# EAGLE design 6relayBoard (EAGLE 6.3)
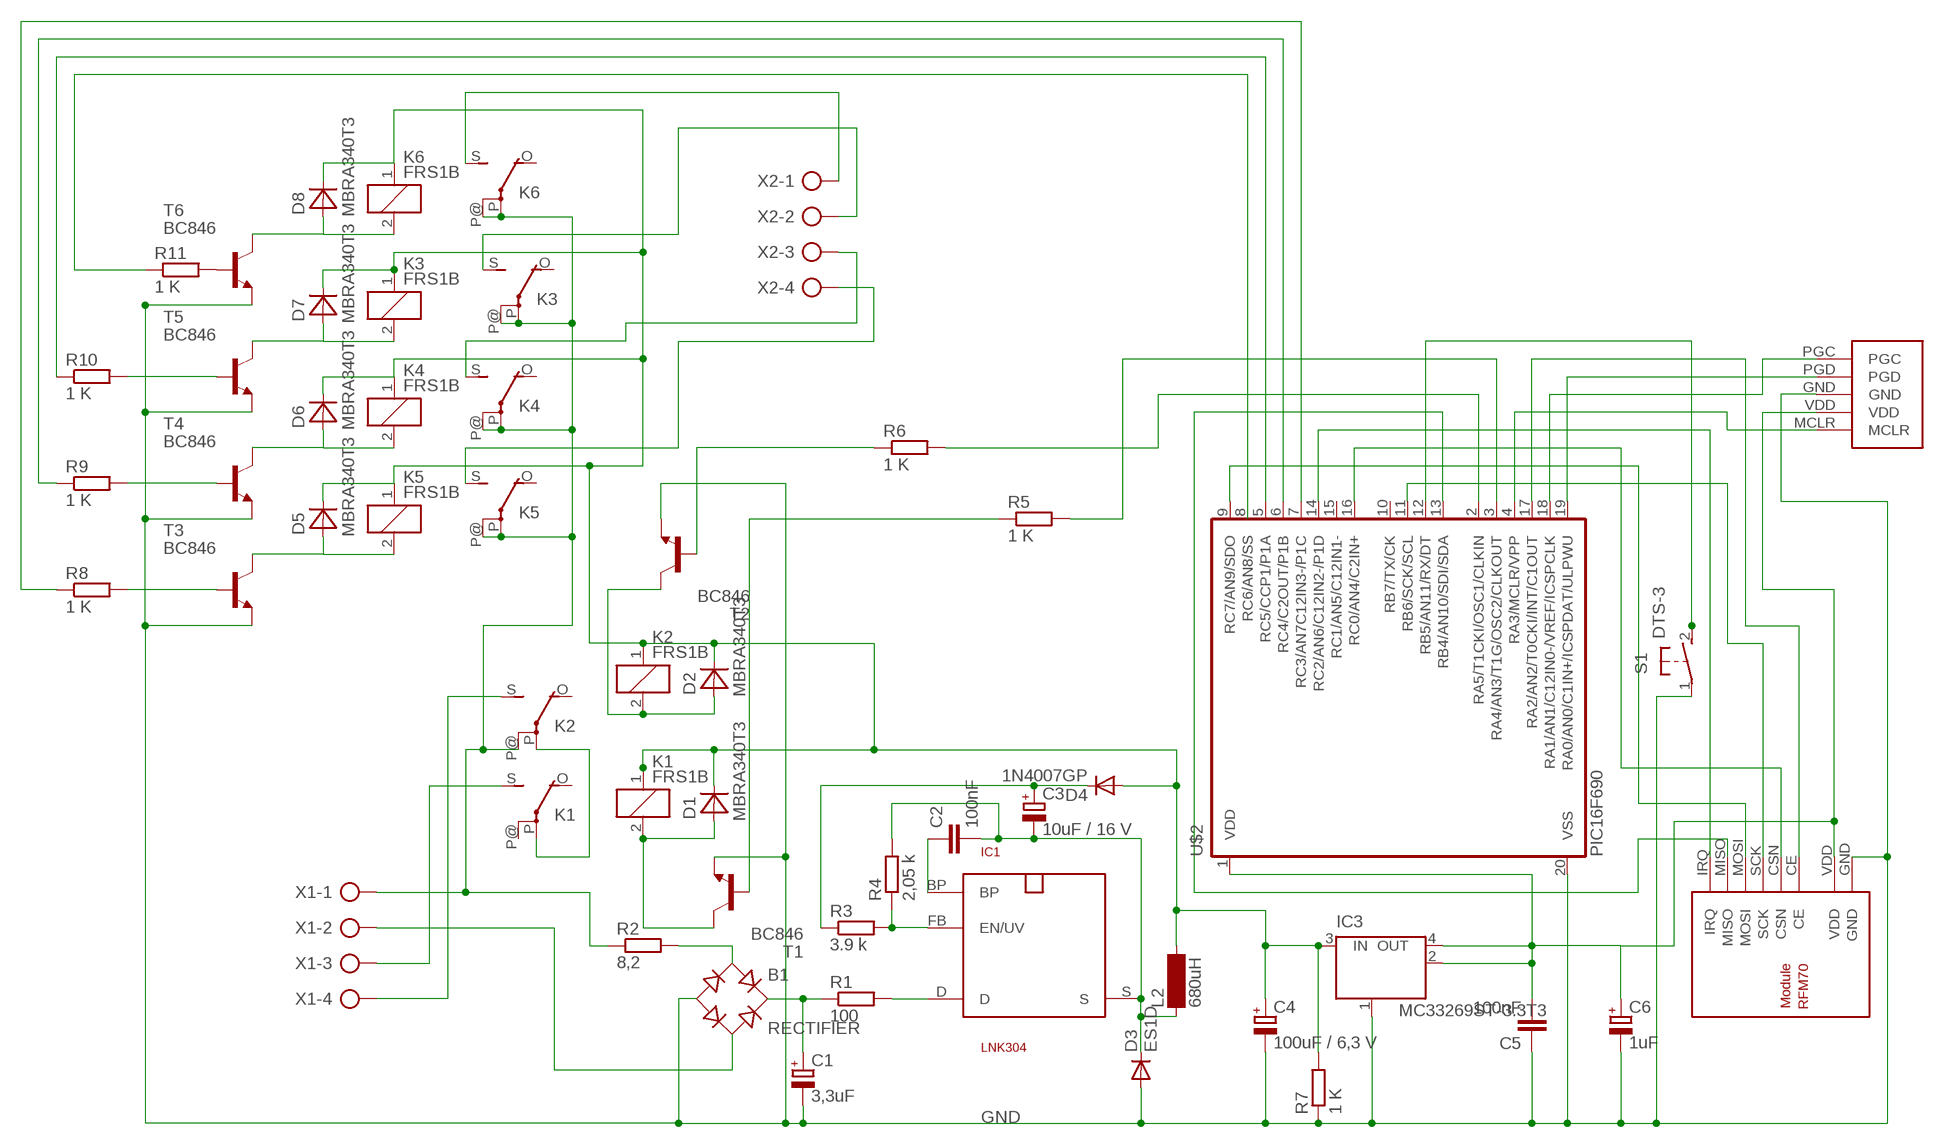
[diagram p0: schematic, sheet 1]

## Parts
B1  RECTIFIER  RECTIFIER-S40  [TO-269AA]
C1  3,3uF  CPOL-EUE5-10.5  [E5-10,5]
C2  100nF  C-EUC2012  [C2012]
C3  10uF / 16 V  CPOL-EUSMCC  [SMC_C]
C4  100uF / 6,3 V  CPOL-EUE2.5-5  [E2,5-5]
C5  100nF  C-EUC2012  [C2012]
C6  1uF  CPOL-EUSMCA  [SMC_A]
D1  MBRA340T3  [SMA]
D2  MBRA340T3  [SMA]
D3  ES1D  DIODE-DO214AC  [DO214AC]
D4  1N4007GP  DIODE-DO214AA  [DO214AA]
D5  MBRA340T3  [SMA]
D6  MBRA340T3  [SMA]
D7  MBRA340T3  [SMA]
D8  MBRA340T3  [SMA]
IC1  LNK304  SO-8C  [SO-8C]
IC3  MC33269ST-3.3T3  [SOT223]
K1  FRS1B  [FRS1B]
K2  FRS1B  [FRS1B]
K3  FRS1B  [FRS1B]
K4  FRS1B  [FRS1B]
K5  FRS1B  [FRS1B]
K6  FRS1B  [FRS1B]
L2  680uH  BS11  [BS11]
R1  100  R-EU_R2512W  [R2512W]
R2  8,2  R-EU_0411/12  [0411/12]
R3  3.9 k  R-EU_M2012  [M2012]
R4  2,05 k  R-EU_M2012  [M2012]
R5  1 K  R-EU_M2012  [M2012]
R6  1 K  R-EU_M2012  [M2012]
R7  1 K  R-EU_M2012  [M2012]
R8  1 K  R-EU_M2012  [M2012]
R9  1 K  R-EU_M2012  [M2012]
R10  1 K  R-EU_M2012  [M2012]
R11  1 K  R-EU_M2012  [M2012]
S1  DTS-3  [DTS-3]
T1  BC846  [SOT23]
T2  BC846  [SOT23]
T3  BC846  [SOT23]
T4  BC846  [SOT23]
T5  BC846  [SOT23]
T6  BC846  [SOT23]
U$1  RFM70  [RFM70]
U$2  PIC16F690  [SSOP20]
U$3  PROGRAMMINGHEADERDIP  [PROGHEADER]
X1  AK500/4  [AK500/4]
X2  AK500/4  [AK500/4]

## Nets
GND: B1.- C1.- C4.- C5.1 C6.- D3.A IC3.1(GND/ADJ) R7.1 S1.1 T1.2(E) T2.2(E) T3.2(E) T4.2(E) T5.2(E) T6.2(E) U$1.GND U$2.20(VSS) U$3.GND
N$1: IC1.D R1.2
N$2: B1.+ C1.+ R1.1
N$3: B1.AC1 R2.2
N$4: B1.AC2 X1.2
N$5: S1.2 U$2.12(RB5/AN11/RX/DT)
N$6: R6.2 U$2.2(RA5/T1CKI/OSC1/CLKIN)
N$7: K1.S(2:S) X1.3
N$8: K2.S(2:S) X1.4
N$9: C3.+ D4.C R3.1
N$10: C2.1 IC1.BP
N$11: IC1.FB(EN/UV) R3.2 R4.1
N$12: U$1.MISO U$2.13(RB4/AN10/SDI/SDA)
N$13: C2.2 C3.- D3.C IC1.S L2.1 R4.2
N$14: D1.A K1.2 T1.3(C)
N$15: R5.1 T1.1(B)
N$16: U$1.CE U$2.17(RA2/AN2/T0CKI/INT/C1OUT)
N$17: C5.2 C6.+ IC3.2(OUT) IC3.4(OUT) U$1.VDD U$2.1(VDD) U$3.VDD
N$18: U$2.19(RA0/AN0/C1IN+/ICSPDAT/ULPWU) U$3.PGD
N$19: U$2.18(RA1/AN1/C12IN0-/VREF/ICSPCLK) U$3.PGC
N$20: U$1.CSN U$2.16(RC0/AN4/C2IN+)
N$21: U$1.IRQ U$2.14(RC2/AN6/C12IN2-/P1D)
N$22: U$1.SCK U$2.11(RB6/SCK/SCL)
N$23: U$1.MOSI U$2.9(RC7/AN9/SDO)
N$24: D2.A K2.2 T2.3(C)
N$25: U$2.4(RA3/MCLR/VPP) U$3.MCLR
N$26: K1.P(2:P) K2.P(2:P)
N$27: C4.+ D1.C D2.C D4.A D5.C D6.C D7.C D8.C IC3.3(IN) K1.1 K2.1 K3.1 K4.1 K5.1 K6.1 L2.2 R7.2
N$28: R6.1 T2.1(B)
N$29: R11.1 U$2.8(RC6/AN8/SS)
N$30: D5.A K5.2 T3.3(C)
N$31: D6.A K4.2 T4.3(C)
N$32: D7.A K3.2 T5.3(C)
N$33: D8.A K6.2 T6.3(C)
N$34: K6.S(2:S) X2.1
N$35: R5.2 U$2.3(RA4/AN3/T1G/OSC2/CLKOUT)
N$36: K2.P@(2:P) K3.P(2:P) K3.P@(2:P) K4.P(2:P) K4.P@(2:P) K5.P(2:P) K5.P@(2:P) K6.P(2:P) K6.P@(2:P) R2.1 X1.1
N$37: K3.S(2:S) X2.2
N$38: K5.S(2:S) X2.4
N$39: K4.S(2:S) X2.3
N$41: R8.2 T3.1(B)
N$42: R9.2 T4.1(B)
N$43: R10.2 T5.1(B)
N$44: R11.2 T6.1(B)
N$45: R10.1 U$2.5(RC5/CCP1/P1A)
N$46: R9.1 U$2.6(RC4/C2OUT/P1B)
N$47: R8.1 U$2.7(RC3/AN7C12IN3-/P1C)
Unconnected: K1.O(2:O) K1.P@(2:P) K2.O(2:O) K3.O(2:O) K4.O(2:O) K5.O(2:O) K6.O(2:O) U$2.10(RB7/TX/CK) U$2.15(RC1/AN5/C12IN1-)

## Library data of the parts
B1 = rectifier:RECTIFIER-: Rectifier
C1 C3 C4 C6 = resistor:CPOL-EU: POLARIZED CAPACITOR, European symbol
C2 C5 = resistor:C-EU: CAPACITOR, European symbol
D1 D2 D5-D8 = diode:MBRA340T3: Surface Mount Schottky Power Rectifier Source: http://www.onsemi.com/pub_link/Collateral/MBRA340T3-D.PDF
D3 D4 = diode:DIODE-: DIODE
IC1 = powerint:SO-8C: 700V MOSFET für Schaltnetz-Trafos. Pin 3 fehlt. SMD
IC3 = linear:MC33269ST*: Adjustable Output Low Dropout Voltage Regulator 800 mA Source: http://www.onsemi.com/pub/Collateral/MC33269-D.PDF
K1-K6 = relay:FRS1B: RELAY 1 x switch, same as V23101-D6-A201, Siemens; OC_FARNELL: unknown; OC_NEWARK: unknown
L2 = inductor-neosid:BS: INDUCTOR nominal inductance, magnetically screened; OC_FARNELL: unknown; OC_NEWARK: unknown
R1-R11 = resistor:R-EU_: RESISTOR, European symbol
S1 = switch-tact:DTS-3
T1-T6 = transistor:BC846: NPN TRANSISTOR
U$1 = rfm70:RFM70: RFM70 2.4 Ghz Funkmodul Autor: Daniel Weber Website: http://projects.web4clans.com Email: daniel.weber@web4clans.com
U$2 = microchip:PIC16F690*: MICROCONTROLLER PIC16F690 18 I/O One 16-bit timer Two 8-bit timer Two comparators Precision internal oscillator-software selectable 8 MHz - 32 KHz SSP w/ I2C Compatible Address mask option EUSART LIN 2.0 Compatible ECCP+ w/ PWM Steering 12 A/D Channels ULPW Enhanced Low Power Timer 1 Timer 1 Gate Synch Latch 4k Program Flash memory 256 bytes SRAM 256 bytes EEPROM
U$3 = rfm70:PROGRAMMINGHEADER
X1 X2 = con-ptr500:AK500/4: CONNECTOR; OC_FARNELL: unknown; OC_NEWARK: unknown

## Board
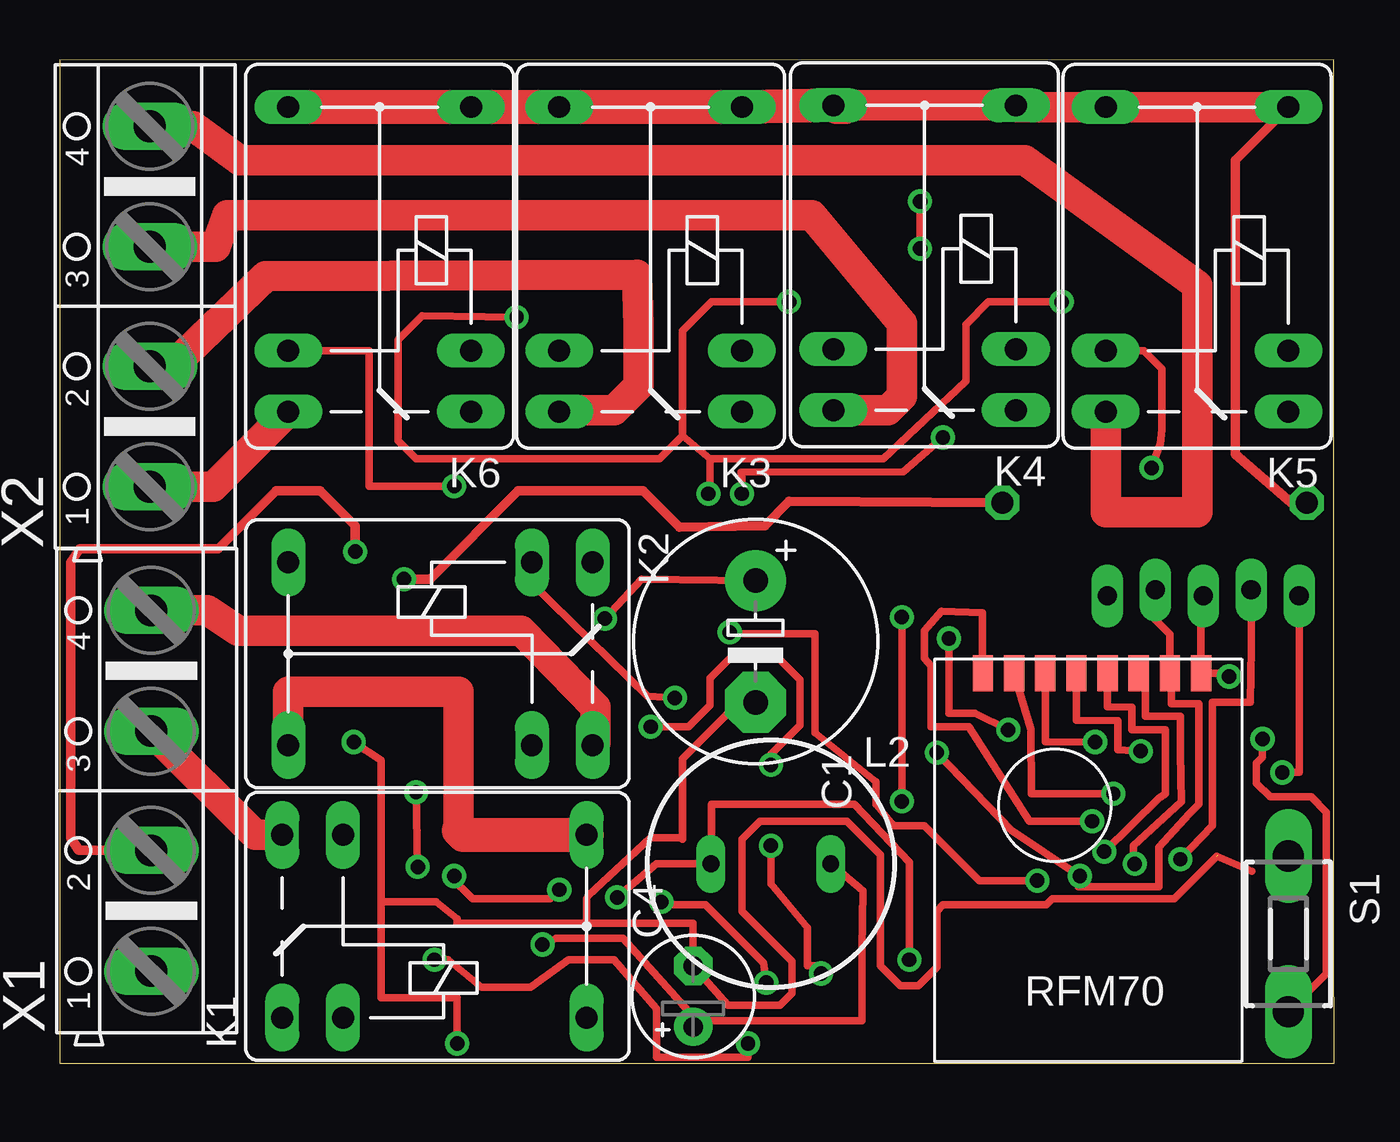
[diagram p1: board, top side]
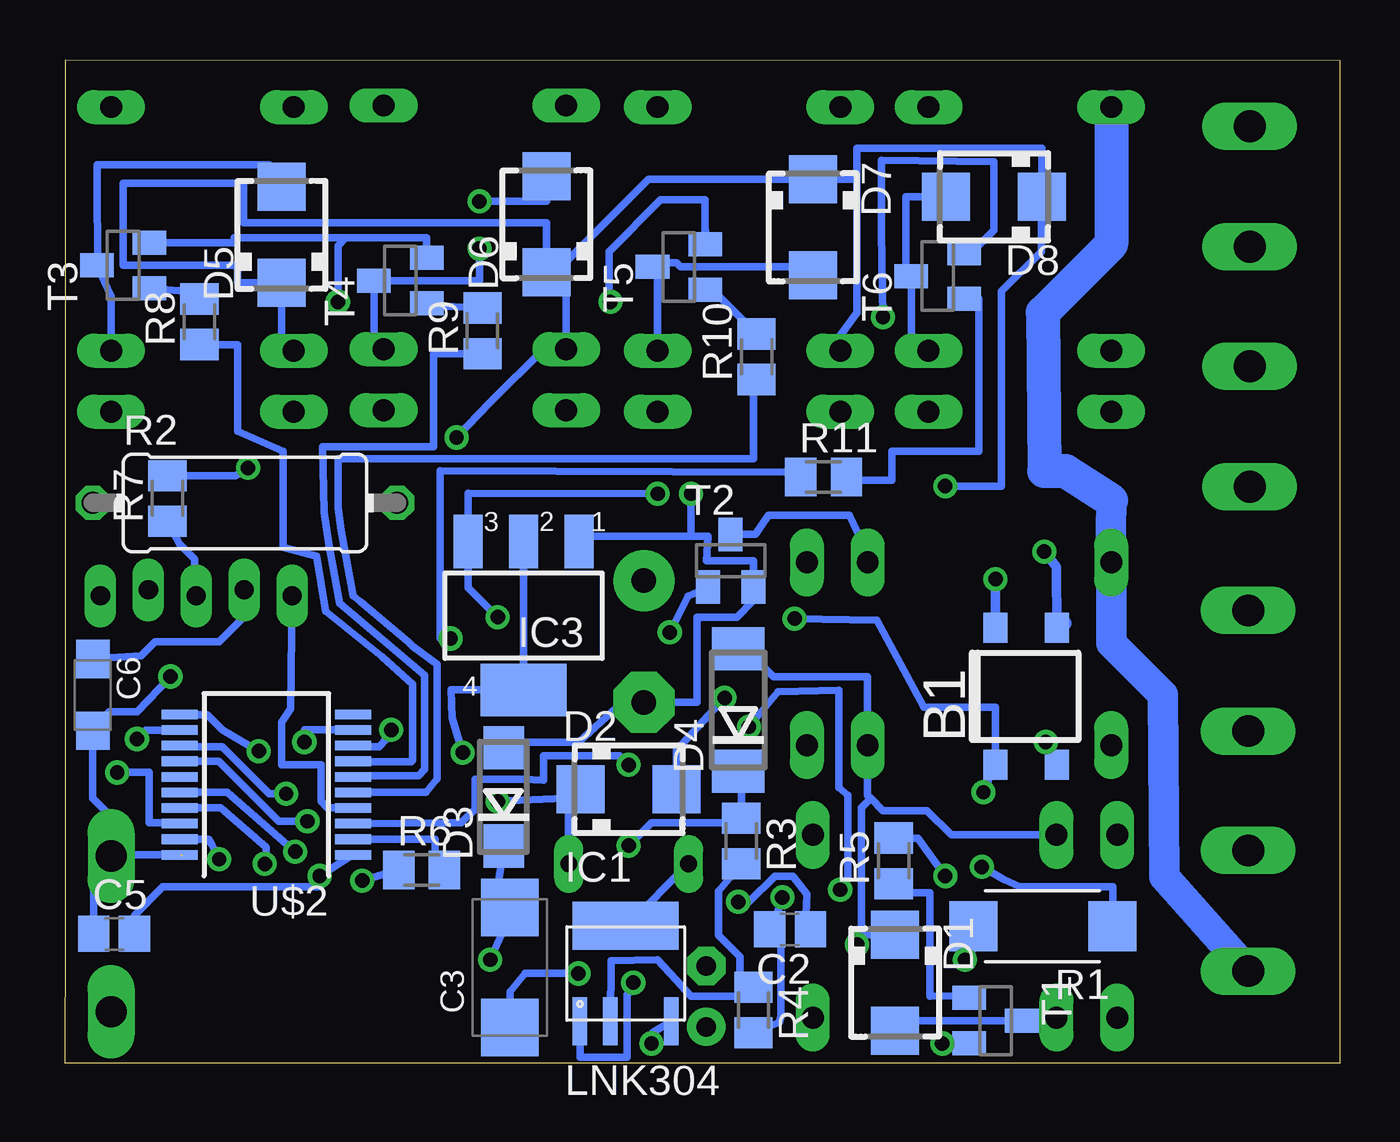
[diagram p2: board, bottom side, seen from below]

Size 53.15 x 41.84 mm. Coordinates in mm from the lower left corner, seen from the top.
Outline: 0,0 53.15,0 53.13,5.52 53.13,41.84 0,41.84 0,0
Copper layers (1*16): Top 0.035mm / dielectric 1.5mm / Bottom 0.035mm
Design rules "default": minimum track width 10mil, minimum drill 24mil, track to track 8mil, track to pad 8mil, pad to pad 8mil, via to via 8mil, smd to smd 8mil, copper to edge 40mil, drill to drill 8mil, minimum pad ring 10mil, minimum via ring 8mil, stop-mask expansion 4mil, vias tented up to drill 0mil, thermal gap 10mil

### Footprints (pad centres in the part's own frame; a part is rotated, then mirrored left to right if it is on the bottom)
TO-269AA = smd 1 x 1.25: + -1.28,-2.855; - 1.28,-2.855; AC1 -1.28,2.855; AC2 1.28,2.855
E5-10,5 = drill 1.016 pad 2.54: + -2.54,0 | drill 1.016 pad 2.54 octagon: - 2.54,0
C2012 = smd 1.3 x 1.5: 1 -0.85,0; 2 0.85,0
SMC_C = smd 2.4 x 2.4: + -2.5,0; - 2.5,0
E2,5-5 = drill 0.813 pad 1.6: + -1.27,0 | drill 0.813 pad 1.6 octagon: - 1.27,0
SMC_A = smd 1.6 x 1.4: + -1.5,0; - 1.5,0
SMA = smd 2 x 2: A 2,0; C -2,0
DO214AC = smd 1.8 x 1.7: A 2.05,0; C -2.05,0
DO214AA = smd 1.8 x 2.2: A 2.55,0; C -2.55,0
SO-8C = smd 0.6 x 2: BP -1.905,-2; D 1.905,-2; FB -0.635,-2 | smd 4.41 x 2: S 0,2
SOT223 = smd 1.219 x 2.235: 1 -2.311,-3.099; 2 0,-3.099; 3 2.311,-3.099 | smd 3.6 x 2.2: 4 0,3.099
FRS1B = drill 0.914 long: 1 0,3.81; 2 0,-3.81; O -2.54,-3.81; P 10.16,3.81; P@ 10.16,-3.81; S -2.54,3.81
BS11 = drill 0.7 long: 1 -2.5,0; 2 2.5,0
R2512W = smd 2 x 2.1: 1 -2.896,0; 2 2.896,0
0411/12 = drill 0.914 octagon: 1 -6.35,0; 2 6.35,0
M2012 = smd 1.3 x 1.6: 1 -0.95,0; 2 0.95,0
DTS-3 = drill 1.3 long: 1 -3.25,0; 2 3.25,0
SOT23 = smd 1 x 1.4: 1 -0.95,-1.1; 2 0.95,-1.1; 3 0,1.1
RFM70 = smd 0.85 x 1.5: CE 2.5,-14.3; CSN 3.8,-14.3; GND -0.1,-14.3; IRQ 9,-14.3; MISO 7.7,-14.3; MOSI 6.4,-14.3; SCK 5.1,-14.3; VDD 1.2,-14.3
SSOP20 = smd 0.4 x 1.5: 1 -2.925,-3.625; 2 -2.275,-3.625; 3 -1.625,-3.625; 4 -0.975,-3.625; 5 -0.325,-3.625; 6 0.325,-3.625; 7 0.975,-3.625; 8 1.625,-3.625; 9 2.275,-3.625; 10 2.925,-3.625; 11 2.925,3.625; 12 2.275,3.625; 13 1.625,3.625; 14 0.975,3.625; 15 0.325,3.625; 16 -0.325,3.625; 17 -0.975,3.625; 18 -1.625,3.625; 19 -2.275,3.625; 20 -2.925,3.625
PROGHEADER = drill 0.8 long: GND 0,0; MCLR -4,0; PGC 4,0; PGD 2,0.25; VDD -2,0.25
AK500/4 = drill 1.321 long: 1 -7.518,0; 2 -2.489,0; 3 2.489,0; 4 7.518,0

### Placement (x,y rotation side)
B1  13.08,15.3 0 bottom
C1  29.02,17.59 270 top
C2  22.92,5.59 180 bottom
C3  34.61,4 90 bottom
C4  26.42,2.79 90 top
C5  51.12,5.4 0 bottom
C6  52.01,15.37 270 bottom
D1  18.54,3.37 270 bottom
D2  29.65,11.43 0 bottom
D3  34.86,11.11 90 bottom
D4  25.08,14.73 90 bottom
D5  44.13,34.54 90 bottom
D6  33.08,34.99 90 bottom
D7  21.97,34.86 270 bottom
D8  14.41,36.13 180 bottom
IC1  29.78,3.75 0 bottom
IC3  34.04,18.67 180 bottom
K1  11.81,5.71 0 top
K2  19.69,17.08 180 top
K3  24.64,29.72 90 top
K4  36.07,29.78 90 top
K5  47.43,29.72 90 top
K6  13.34,29.72 90 top
L2  29.65,8.32 0 top
R1  12.38,5.71 180 bottom
R2  45.66,23.37 0 bottom
R3  24.96,9.27 270 bottom
R4  24.45,2.22 270 bottom
R5  18.61,8.45 90 bottom
R6  38.29,8.06 0 bottom
R7  48.9,23.56 90 bottom
R8  47.56,30.92 90 bottom
R9  35.75,30.54 90 bottom
R10  24.32,29.46 90 bottom
R11  21.53,24.45 0 bottom
S1  51.24,5.4 270 top
T1  14.35,1.78 270 bottom
T2  25.4,20.95 0 bottom
T3  50.74,33.27 90 bottom
T4  39.18,32.64 90 bottom
T5  27.56,33.21 90 bottom
T6  16.76,32.83 90 bottom
U$1  47.5,1.97 180 top
U$2  44.77,11.62 90 bottom
U$3  47.69,19.49 0 top
X1  3.81,11.37 90 top
X2  3.75,31.56 90 top

### Tracks (layer width: path | path; a pad name or v marks a point on that pad's centre or on a via)
GND  (via drill 0.6)  (1 unrouted)
  Top 0.305: v16.57,0.83 16.57,2.73 13.4,2.73 13.4,6.73 | 13.4,6.73 13.4,12.64 v12.26,13.4 | 21.97,5.84 26.42,5.84 C4.- 27.88,2.41 30.04,2.41 30.54,2.92 30.54,4.25 28.45,6.35 28.45,9.34 29.21,10.1 32.83,10.1 34.23,8.7 34.23,4.06 35.05,3.24 35.81,3.24 36.58,4 36.58,6.35 36.83,6.6 41.15,6.6 41.4,6.86 46.48,6.86 48.26,8.64 49.71,8 | 21.97,5.84 16.57,5.84 16.57,6.03 15.68,6.73 13.4,6.73 | C1.- 28.32,15.05 25.97,12.7 25.97,9.34 25.91,9.4 24.64,9.4 22.04,6.99 21.97,6.86 21.97,5.84 | v30.42,31.75 27.18,31.75 25.97,30.54 25.97,26.16 | 25.97,26.16 27.11,25.21 | 27.11,25.21 34.35,25.21 37.78,28.45 37.78,30.8 38.73,31.75 v41.78,31.75 | 27.11,25.21 27.11,23.81 v27.05,23.75 | v19.05,31.11 15.11,31.18 14.1,30.16 14.1,25.97 14.86,25.21 25.02,25.21 25.97,26.16 | U$3.GND 47.6,19.4 U$1.GND 48.56,16.27 v48.77,16.13
  Bottom 0.305: T1.2 v16.57,0.83 | B1.- 11.87,12.45 v12.26,13.4 | IC3.1 31.62,21.13 31.62,21.97 27.05,21.97 | 27.05,21.97 26.35,21.97 26.42,20.95 24.45,20.95 T2.2 24.45,19.3 25.15,18.61 26.8,18.61 26.8,15.05 C1.- 29.91,15.05 31.75,13.4 34.86,13.4 35.12,12.95 D3.A | T3.2 46.04,34.22 46.1,34.42 41.47,34.42 | 41.47,34.42 38.08,34.42 T4.2 | T6.2 15.37,33.78 14.41,34.73 14.41,37.59 19.11,37.66 19.11,34.67 v19.05,31.11 | 26.46,34.73 T5.2 26.48,34.16 26.48,36.01 28.32,36.01 30.48,33.85 30.48,31.81 v30.42,31.75 | v41.78,31.75 41.78,34.1 41.47,34.42 | v27.05,23.75 27.05,21.97 | 48.45,8.64 U$2.20 | U$2.20 48.32,8.7 | v48.77,16.13 50.16,14.67 51.33,14.67 C6.- 52.01,11.05 51.24,10.29 S1.1 | C5.1 51.97,7.92 S1.1 | R7.1 48.39,21.65 47.75,21.02 47.75,19.56 U$3.GND | U$2.20 51.24,8.7 S1.1
N$1  (via drill 0.6)
  Top 0.305: v15.62,4.32 16.19,4.32 17.59,3.17 19.62,3.17 21.21,4.32 23.11,4.32 24.89,2.29 24.89,0.25 28.7,0.25 v28.7,0.83
  Bottom 0.305: R1.2 14.48,5.71 v15.62,4.32 | v28.7,0.83 28.64,1.3 IC1.D
N$2  (via drill 0.6)
  Top 0.305: v14.86,11.3 v14.92,8.19 | v22.73,18.54 24.26,20.19 C1.+
  Bottom 0.305: v14.86,11.3 B1.+ 14.35,14.86 17.34,14.86 19.3,18.48 v22.73,18.54 | v14.92,8.19 14.03,7.68 13.34,7.37 9.46,7.37 R1.1
N$3  (via drill 0.6)
  Top 0.406: R2.2 30.42,23.43 29.4,22.42 25.84,22.35 24.32,23.88 19.11,23.88 15.43,20.19 v14.35,20.19
  Bottom 0.406: v14.35,20.19 14.35,18.17 B1.AC1
N$4  (via drill 0.6)
  Top 0.406: X1.2 0.78,8.88 0.44,9.4 0.44,20.89 0.82,21.46 6.6,21.46 9.02,23.88 10.86,23.88 12.32,22.42 v12.32,21.34
  Bottom 0.406: v12.32,21.34 11.81,20.71 B1.AC2
  Bottom 0.61: 11.48,18.35 B1.AC2
N$5  (via drill 0.6)
  Top 0.305: v50.16,13.53 50.16,12.76 49.91,12.51 49.91,11.68 50.48,11.11 52.2,11.11 52.83,10.48 52.83,3.73 S1.2
  Bottom 0.305: U$2.12 49.8,13.9 v50.16,13.53
N$6
  Bottom 0.305: U$2.2 37.73,9.35 37.72,8.95 37.72,8.64 R6.2
N$7
  Top 1.27: K1.S 8.14,9.53 X1.3
N$8
  Top 1.27: X1.4 6.13,18.89 7.43,18.03 19.24,18.03 22.35,14.86 22.35,13.4 K2.S
N$9  (via drill 0.6)
  Top 0.305: v29.66,9.08 29.66,7.49 31.18,5.65 31.18,4.06 31.5,4.06 v31.75,3.75
  Bottom 0.305: D4.C 24.96,11.48 R3.1 25.28,10.22 25.46,10.03 28.7,10.03 v29.66,9.08 | C3.+ 34.61,2.98 33.97,3.75 v31.75,3.75
N$10  (via drill 0.6)
  Top 0.305: v29.46,3.37 29.34,4.19 26.92,6.6 25.21,6.6 v25.08,6.73
  Bottom 0.305: IC1.BP 31.69,0.25 29.72,0.25 29.72,2.86 29.46,3.11 v29.46,3.37 | v25.08,6.73 24.64,6.73 23.56,7.81 22.8,7.81 22.23,7.05 22.29,5.8 C2.1
N$11
  Bottom 0.305: IC1.FB 30.38,4.29 28.45,4.32 27.69,3.49 27.05,2.79 24.7,2.79 R4.1 24.83,3.37 25.02,3.81 25.02,4.45 25.91,5.33 25.91,7.18 R3.2
N$12  (via drill 0.6)
  Top 0.305: U$1.MISO 40.5,13.92 40.51,11.24 v43.94,11.24
  Bottom 0.305: v43.94,11.24 44.64,11.24 46.61,13.21 48.36,13.21 U$2.13
N$13  (via drill 0.6)
  Top 0.305: v23.24,6.92 24.89,8.32 L2.1 27.18,8.34 27.18,10.79 33.15,10.79 35.43,8.38 v35.43,4.32
  Bottom 0.305: v23.24,6.92 23.62,5.74 C2.2 23.3,4.99 23.3,1.97 23.37,1.72 R4.2 | IC1.S 29.73,5.75 L2.1 | D3.C 35.18,6.95 C3.- 34.54,6.31 v35.43,4.32
N$14
  Bottom 0.305: K1.2 T1.3 18.99,1.78 D1.A
N$15
  Bottom 0.305: T1.1 15.45,2.81 17.08,2.79 17.08,7.11 18.22,7.11 R5.1
N$16  (via drill 0.6)
  Top 0.305: U$1.CE 45.28,16.27 45.28,14.48 46.74,14.48 46.74,12.95 46.78,10.9 44.77,9.08 44.77,8.38 v44.83,8.32
  Bottom 0.305: v44.83,8.32 44.77,8.38 44.77,9.02 46.67,10.67 48.41,10.67 U$2.17
N$17  (via drill 0.6)
  Top 0.305: v36.58,12.95 39.69,9.72 v42.55,7.81 42.48,7.68 42.48,7.37 45.85,7.37 45.85,9.02 47.12,10.41 47.5,10.79 47.5,14.99 46.36,14.99 46.36,16.27 U$1.VDD 46.3,17.9 45.66,18.54 45.66,19.71 U$3.VDD
  Bottom 0.305: IC3.2 IC3.4 37.07,15.57 37.02,14.41 v36.58,12.95 | U$2.1 41.65,8.38 v42.55,7.81 42.8,7.56 42.48,7.43 42.55,7.37 49.09,7.37 50.27,6.18 C5.2 | C6.+ 50,16.99 49.4,17.59 46.74,17.59 45.66,18.67 45.66,19.71 U$3.VDD
N$18  (via drill 0.6)
  Top 0.305: 49.66,15.05 49.69,17.3 U$3.PGD | 49.66,15.05 48.07,15.05 48.07,9.91 v46.74,8.51 | 49.66,15.11 49.66,15.05
  Bottom 0.305: v46.74,8.51 47.05,9.14 47.18,9.34 48.38,9.34 U$2.19
N$19  (via drill 0.6)
  Top 0.305: U$3.PGC 51.69,12.13 v50.99,12.13
  Bottom 0.305: v50.99,12.13 49.66,12.13 49.66,10.03 48.96,10.03 48.42,9.97 U$2.18
N$20  (via drill 0.6)
  Top 0.305: v43.56,8.83 45.85,11.05 46.1,11.24 46.1,13.91 44.7,13.91 44.7,14.86 43.69,14.86 U$1.CSN
  Bottom 0.305: U$2.16 46.41,11.3 v43.56,8.83
N$21  (via drill 0.6)
  Top 0.305: v43.05,10.1 40.45,10.1 37.91,14.03 36.32,14.03 36.32,16.57 36.07,16.89 36.07,18.03 36.77,18.86 38.48,18.8 38.48,16.19 U$1.IRQ
  Bottom 0.305: U$2.14 46.76,12.6 44.26,10.1 v43.05,10.1
N$22  (via drill 0.6)
  Top 0.305: U$1.SCK 42.4,14.31 44.13,14.29 44.13,13.08 v45.09,13.02
  Bottom 0.305: v45.09,13.02 46.61,13.91 47.24,14.54 U$2.11
N$23  (via drill 0.6)
  Top 0.305: U$1.MOSI 41.1,13.41 v43.18,13.4
  Bottom 0.305: v43.18,13.4 43.18,13.91 41.15,13.91 U$2.9
N$24  (via drill 0.6)
  Top 0.305: v25.65,15.24 24.51,15.3 19.69,20 K2.2
  Bottom 0.305: T2.3 24.36,22.05 23.81,22.86 20.45,22.86 19.75,21.4 K2.2 | D2.A 27.66,13.05 v25.65,15.24
N$25
  Bottom 0.305: U$3.MCLR 43.75,14.79 44.13,14.22 44.13,12.45 42.48,12.45 42.48,10.92 42.23,10.67 41.16,10.67 U$2.4
N$26
  Top 1.27: K2.P 9.53,15.49 16.64,15.49 16.64,9.72
  Top 1.422: 16.64,9.72 16.83,9.53 K1.P
N$27  (via drill 0.6)
  Top 0.305: L2.2 33.49,7.2 33.47,4.75 33.47,1.78 26.73,1.78 26.42,1.97 | C4.+ 26.42,1.97 | 26.42,1.97 23.5,5.21 20.7,5.21 v20.13,4.95 | v36.83,26.1 35.18,24.68 28.41,24.64 28.45,24.41 v28.45,23.75 | K6.1 12.89,29.72 12.89,24.07 v16.45,24.07 | v45.53,24.83 45.91,25.84 45.97,26.42 45.97,28.96 45.21,29.72 K5.1 | v35.12,18.61 v35.12,10.92
  Bottom 0.305: K1.1 16.19,9.53 17.21,10.54 19.05,10.54 19.56,11.05 | 19.56,11.05 19.69,11.18 K2.1 19.69,16.13 23.62,16.13 24.51,17.02 25.64,17.02 D4.A | D1.C 19.94,5.37 | 19.94,5.37 19.94,10.67 19.56,11.05 | v20.13,4.95 20.1,5.02 19.94,5.37 | v35.12,10.92 32.26,11.05 | 32.26,11.05 32.16,11.05 L2.2 | v28.45,23.75 36.35,23.77 IC3.3 36.35,19.84 v35.12,18.61 | D2.C 31.88,11.56 32,11.3 32.26,11.05 | K5.1 44.13,29.72 D5.C 45.97,32.54 45.97,33.27 50.74,33.27 50.74,36.7 45.72,36.7 45.72,35.05 33.08,35.05 D6.C 32.26,33.43 | 32.26,33.43 K4.1 33.21,29.78 35.43,27.56 v36.83,26.1 | 32.26,33.43 28.83,36.86 D7.C 20.13,36.86 | 20.13,36.86 20.13,38.16 12.41,38.16 D8.C 12.45,36.1 12.45,33.85 14.1,32.19 14.1,24.07 v16.45,24.07 | K3.1 20.83,30.35 20.13,31.3 20.13,36.86 | R7.2 46.04,24.51 v45.53,24.83
N$28  (via drill 0.6)
  Top 0.305: v27.94,17.97 28.51,17.91 31.5,17.91 31.5,13.78 34.04,11.75 34.04,10.79 34.8,9.91 36.07,9.91 38.35,7.62 v40.77,7.62
  Bottom 0.305: R6.1 v40.77,7.62 | v27.94,17.97 27.18,19.48 T2.1
N$29  (via drill 0.6)
  Top 0.305: v37.08,17.72 37.08,14.61 38.16,14.61 v39.56,13.91
  Bottom 0.305: R11.1 22.99,24.64 37.53,24.7 37.53,17.72 37.15,17.65 v37.08,17.72 | v39.56,13.91 39.75,13.53 40.07,13.21 41.18,13.21 U$2.8
N$30
  Bottom 0.305: K5.2 51.24,31.98 T3.3 51.78,33.08 51.82,35.69 51.82,37.47 44.64,37.47 44.64,36.54 D5.A
N$31  (via drill 0.6)
  Top 0.305: v35.88,33.97 v35.88,35.94
  Bottom 0.305: K4.2 40.28,29.78 T4.3 35.88,32.64 v35.88,33.97 | v35.88,35.94 33.08,35.94 D6.A
N$32
  Bottom 0.305: K3.2 28.45,33.38 | 28.45,33.38 T5.3 | 28.45,33.38 27.67,33.38 27.5,33.21 21.94,33.21 D7.A
N$33
  Bottom 0.305: D8.A 18.1,36.13 18.1,32.83 T6.3 17.86,29.72 K6.2
N$34
  Top 1.27: X2.1 6.39,24.04 K6.S
N$35  (via drill 0.6)
  Top 0.305: v29.66,12.45 29.66,12.89 30.86,14.1 30.86,16 29.91,16.95 28,16.95 27.11,16.07 27.11,14.92 26.23,14.03 v24.64,14.03 | v16.45,7.81 16.26,7.81 17.21,6.86 20.45,6.86 v20.83,7.24
  Bottom 0.305: U$2.3 37.08,10.03 36.64,10.03 36.07,10.6 36.07,11.84 34.07,11.84 33.21,11.81 33.21,12.83 30.04,12.83 v29.66,12.45 | R5.2 17.59,9.4 v16.45,7.81 | v20.83,7.24 20.83,7.43 20.51,7.75 20.51,11.18 20.89,11.49 20.89,15.56 23.43,15.49 v24.64,14.03
N$36
  Top 0.406: R2.1 51.37,23.37 49.02,25.4 49.02,37.66 K5.P@
  Top 1.27: K5.P K5.P@ 39.94,39.88 K4.P@ 32.89,39.94 32.77,39.81 32.38,39.81 K4.P | 28.51,39.88 K3.P@
  Top 1.422: K4.P 28.51,39.88 | K3.P@ K3.P K6.P@ K6.P
  Bottom 1.27: 9.53,23.47 9.56,20.93 K2.P@ 9.53,17.53 7.37,15.37 7.3,7.79 X1.1
  Bottom 1.422: K6.P 9.53,34.16 12.38,31.3 12.32,24.7 11.43,24.7 9.53,23.47
N$37
  Top 1.27: X2.2 4.69,29.07 8.57,32.83 24.07,32.89 24.13,30.73 24.13,28.26 23.11,27.24 20.89,27.24 K3.S
N$38
  Top 1.27: X2.4 5.56,39.08 7.49,37.66 40.26,37.66 47.43,32.45 47.43,22.99 43.62,22.99 K5.S
N$39
  Top 1.27: X2.3 6.49,34.05 6.98,35.37 31.37,35.37 35.12,30.86 35.12,27.81 34.54,27.24 K4.S
N$41
  Bottom 0.305: T3.1 47.43,32.13 R8.2
N$42
  Bottom 0.305: R9.2 38.08,31.62 T4.1
N$43
  Bottom 0.305: T5.1 26.17,32.26 R10.2
N$44
  Bottom 0.305: T6.1 15.05,31.88 15.05,25.53 18.67,25.53 18.67,24.32 20.58,24.32 R11.2
N$45
  Bottom 0.305: R10.1 24.45,28.51 24.45,25.21 41.78,25.21 41.78,23.18 41.66,22.23 41.15,19.49 40.83,19.24 38.86,17.59 38.67,17.4 37.66,16.64 37.66,11.87 38.1,11.3 U$2.5
N$46
  Bottom 0.305: R9.1 37.78,29.59 37.78,25.72 42.42,25.72 42.36,22.99 42.16,21.72 41.72,19.18 38.16,16.19 38.16,12.26 38.42,12 41.14,12 U$2.6
N$47
  Bottom 0.305: R8.1 45.97,29.97 45.97,26.35 44.07,25.53 44.07,21.53 42.67,21.14 42.29,18.86 39.94,16.95 38.67,15.81 38.67,12.64 38.73,12.57 41.14,12.57 U$2.7